# Altium schematic sheet USB_mini.SchDoc
size A4; Organization: Altium Limited; Address1: L3, 12a Rodborough Rd; Address2: Frenchs Forest; Address3: NSW; Address4: Australia 2086
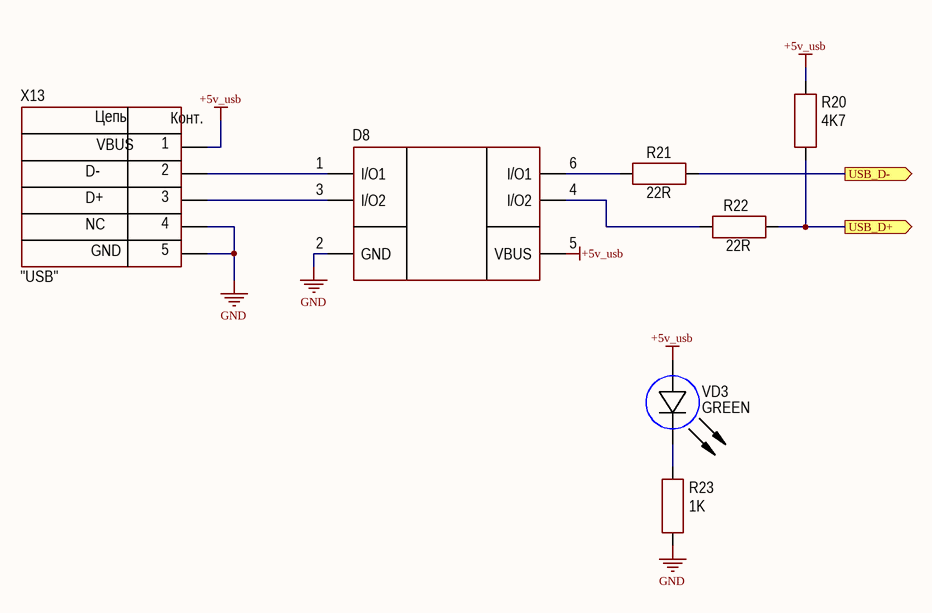
[diagram p0: USB_mini.SchDoc]

## Parts
D8  (no value)  [SOT23-6]
R20  value 4K7  [RES: 1206]
R21  value 22R  [RES: 1206]
R22  value 22R  [RES: 1206]
R23  value 1K  [RES: 1206]
VD3  Color: GREEN  [LED: 1206G]
X13  CommentText: "USB"  [CON: 0675031020]

## Ports
USB_D+ (out), USB_D- (out)

## Nets
+5v_usb: D8.5(VBUS) R20.1 VD3.1(A) X13.1
GND: D8.2(GND) R23.1 X13.4 X13.5
USB_D+: R20.2 R22.2 ; port USB_D+
USB_D-: R21.2 ; port USB_D-
NetD8_1: D8.1(I/O1) X13.2
NetD8_3: D8.3(I/O2) X13.3
NetD8_4: D8.4(I/O2) R22.1
NetD8_6: D8.6(I/O1) R21.1
NetR23_2: R23.2 VD3.2(C)

## Notes on the sheet
- Title
- Size:
- Date:
- File:
- A0
- Number:
- Time:
- Revision:
- Sheet
- of
- (in symbol Connector_USB_mini_B) Цепь; Конт.; VBUS; D-; D+; NC; GND

## Library data of the parts
D8 = USBLC6-2SC6: Manufacturer: STMicroelectronics; TypeDiode: USB protection; Current: 5A peak; VoltageDrop: 17V; RecoveryTime: Power line; Package: SOT-23-6; HelpURL: https://www.digikey.com/product-detail/en/stmicroelectronics/USBLC6-2SC6/497-5235-1-ND/1121688; ValueManufacturerPartNumber: =TypeDiode+', '+Voltage+', '+Current+', '+VoltageDrop+', '+RecoveryTime+', '+Package+', '+Temperature; Temperature: -40...+125°C; PartNumber: USBLC6-2SC6
R20 = Resistor_1206: Manufacturer: Yageo; PartNumber: RC1206JR-07100RL; ValueManufacturerPartNumber: Resistor film, 4K7, ±5%, 1206, 0.25W, -55...+125°C; TypeResistor: Resistor film; Power: 0.25W; Tolerance: ±5%; Package: 1206; HelpURL: https://www.digikey.com/product-detail/en/yageo/RC1206JR-07100RL/311-100ERCT-ND/732153; Temperature: -55...+125°C
R21 R22 = Resistor_1206: Manufacturer: Yageo; PartNumber: RC1206JR-07100RL; ValueManufacturerPartNumber: Resistor film, 22R, ±5%, 1206, 0.25W, -55...+125°C; TypeResistor: Resistor film; Power: 0.25W; Tolerance: ±5%; Package: 1206; HelpURL: https://www.digikey.com/product-detail/en/yageo/RC1206JR-07100RL/311-100ERCT-ND/732153; Temperature: -55...+125°C
R23 = Resistor_1206: Manufacturer: Yageo; PartNumber: RC1206JR-07100RL; ValueManufacturerPartNumber: Resistor film, 1K, ±5%, 1206, 0.25W, -55...+125°C; TypeResistor: Resistor film; Power: 0.25W; Tolerance: ±5%; Package: 1206; HelpURL: https://www.digikey.com/product-detail/en/yageo/RC1206JR-07100RL/311-100ERCT-ND/732153; Temperature: -55...+125°C
VD3 = LED_single: ValueManufacturerPartNumber: LED, Green, *, *, *, -55...+150°C; TypeDiode: LED; Manufacturer: *; Package: *; HelpURL: *; Temperature: -55...+150°C; Current: *; VoltageDrop: *; PartNumber: *; ColorParameter: Green
X13 = Connector_USB_mini_B: Manufacturer: Molex; ValueManufacturerPartNumber: USB mini B; PartNumber: 0675031020; HelpURL: https://www.digikey.com/product-detail/en/molex/0675031020/WM5461CT-ND/1624427; TypeConnector: USB mini B